# EAGLE design TALLER2 (EAGLE 7.6.0)
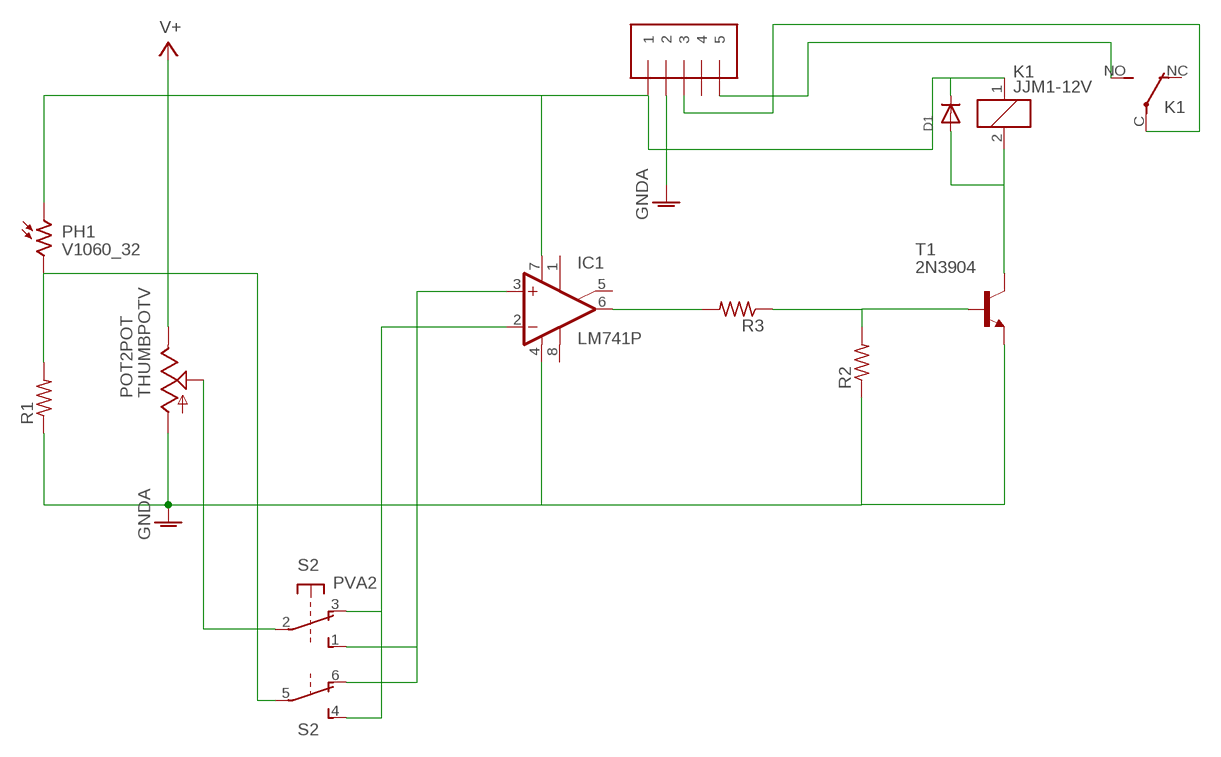
[diagram p0: schematic, sheet 1]

## Parts
D1  DIODEDO-1N4148  [DO-1N4148]
IC1  LM741P  [DIL08]
J2  1X5  [1X05-3.5MM]
K1  JJM1-12V  [JJM1C]
PH1  V1060_32  [TO-5_V10]
POT2  THUMBPOTV  [THUMBWHEELV]
R1  R-US_0207/10  [0207/10]
R2  R-US_0207/10  [0207/10]
R3  R-US_0207/10  [0207/10]
S2  PVA2  [PVA2F]
T1  2N3904  [TO92]

## Nets
GNDA: IC1.4(V-) J2.2 POT2.A(POT:A) R1.1 R2.1 T1.3(E)
N$2: PH1.2 R1.2 S2.5(2:P)
N$4: POT2.S(POT:S) S2.2(1:P)
N$5: IC1.2(-IN) S2.3(1:O) S2.4(2:S)
N$6: IC1.3(+IN) S2.1(1:S) S2.6(2:O)
N$7: IC1.6(OUT) R3.2
N$8: R2.2 R3.1 T1.2(B)
N$9: D1.A K1.2 T1.1(C)
N$12: J2.5 K1.NO(2:S)
N$13: J2.3 K1.C(2:P)
V+: D1.C IC1.7(V+) J2.1 K1.1 PH1.1 POT2.E(POT:E)
Unconnected: IC1.1(ON1) IC1.5(ON2) IC1.8(OPT) J2.4 K1.NC(2:O) POT2.SW1(SW:S) POT2.SW2(SW:P)

## Library data of the parts
D1 = adafruit:DIODE: Diode SMADIODE - SMA Surface Mount Package 20V 1A Schottky Diode Digikey: 641-1014-6-ND DO-1N4148 - Through Hole Small Current Diode SOD-123 20V 1 A (.5mV Vf) Schottky Diode - Digikey: MBRX120TPMSCT-ND SOD-323 10V 570mA (.38mV Vf, 3ns) Schottky Diode - Digikey: ZLLS410CT-ND SOD-523 30V 30mA Schottky Diode (RB751S-40TE61) - Digikey: RB751S-40TE61CT-ND SOT23-R/W - SOT23 Package (R = Solder Paste/Reflow Ovens, W = Hand-Soldering) BAT54Film 40V 300mA - Digikey: 497-7162-1-ND
IC1 = opams:*741: OP AMP
J2 = adafruit:1X5
K1 = relay:JJM1-12V: HALF-SIZE AUTOMOTIVE RELAY NAiS Source: http://www.mew-europe.com/.. en_ds_61210_0001.pdf; MF: AROMAT/ MATSUSHITA; MPN: JJM1-12V; OC_FARNELL: unknown; OC_NEWARK: 10C7318
PH1 = photo-elements:?1060*: Sensor Street Light control Source: http://optoelectronics.perkinelmer.com/content/Datasheets/DTS_PhotocellsB1060.pdf
POT2 = adafruit:THUMBPOT: Thumbwheel pot with switch Available in horizontal (Alpha RV121SF) or vertical (Xicon 311-1701)
R1-R3 = adafruit:R-US_: RESISTOR, American symbol
S2 = switch-misc:PVA2: ITT SWITCH
T1 = transistor:2N3904: NPN TRANSISTOR

## Board
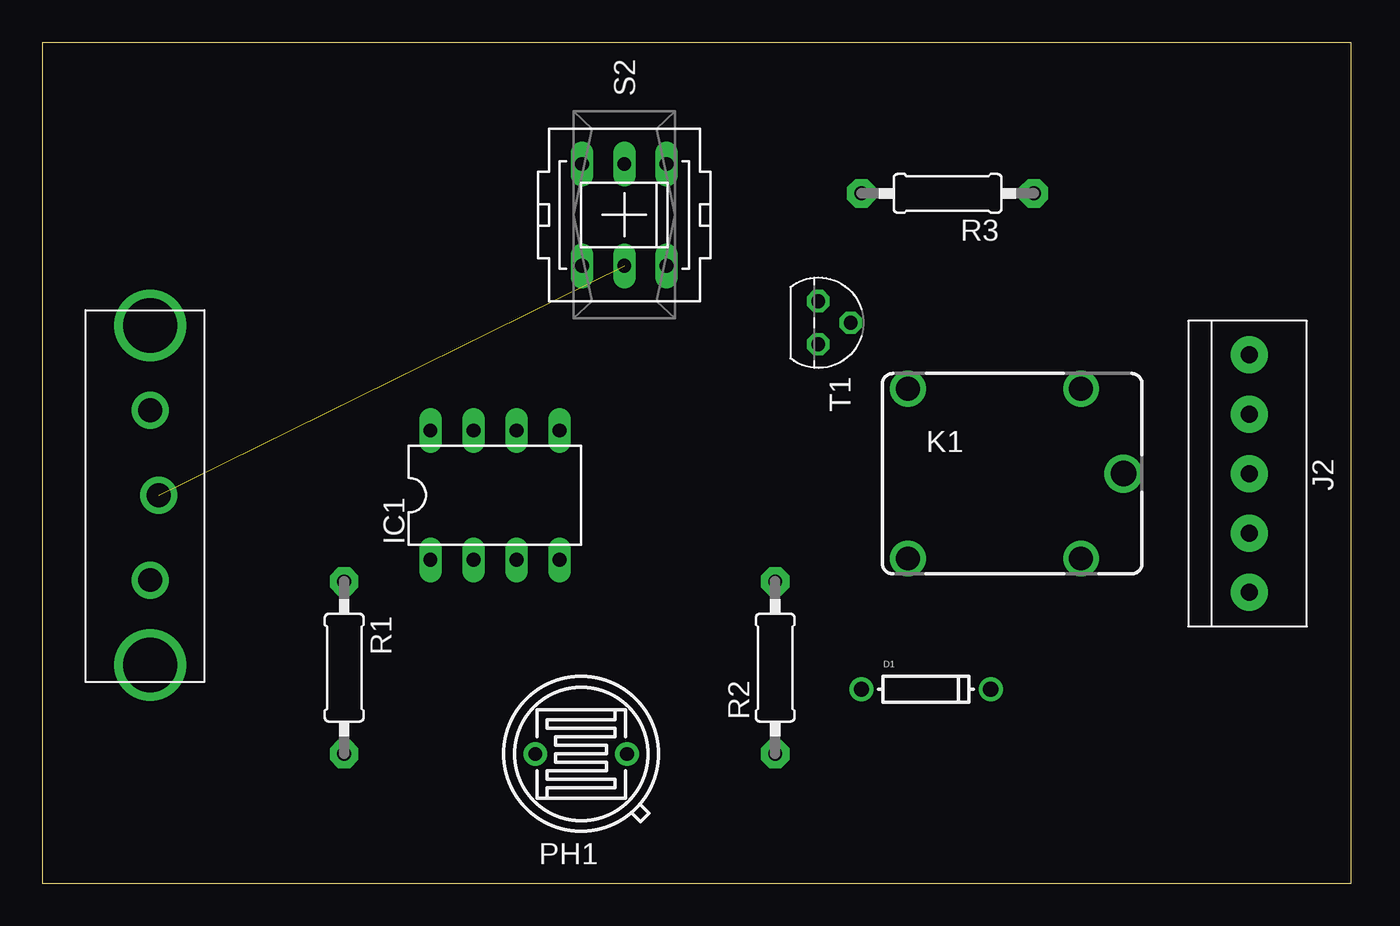
[diagram p1: board, top side]
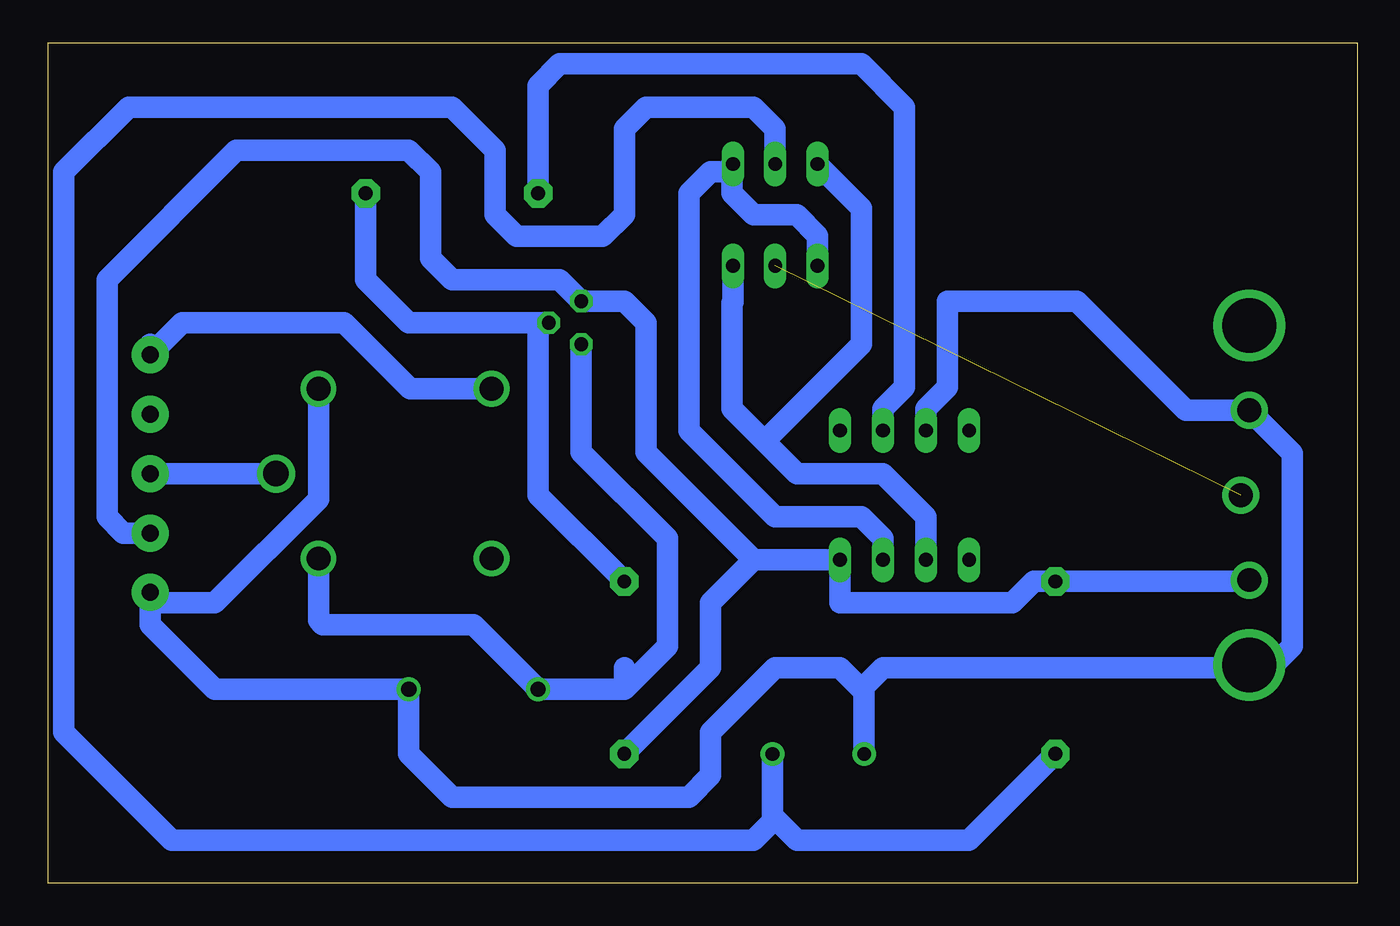
[diagram p2: board, bottom side, seen from below]

Size 77.14 x 49.52 mm. Coordinates in mm from the lower left corner, seen from the top.
Outline: 0,0 77.14,0 77.14,49.52 0,49.52 0,0
Copper layers (1*16): Top 0.035mm / dielectric 1.5mm / Bottom 0.035mm
Design rules "default *": minimum track width 10mil, minimum drill 24mil, track to track 20mil, track to pad 25mil, pad to pad 8mil, via to via 8mil, smd to smd 8mil, copper to edge 40mil, drill to drill 8mil, minimum pad ring 10mil, minimum via ring 8mil, stop-mask expansion 4mil, vias tented up to drill 0mil, thermal gap 10mil

### Footprints (pad centres in the part's own frame; a part is rotated, then mirrored left to right if it is on the bottom)
DO-1N4148 = drill 0.9: A -3.81,0; C 3.81,0
DIL08 = drill 0.813 long: 1 -3.81,-3.81; 2 -1.27,-3.81; 3 1.27,-3.81; 4 3.81,-3.81; 5 3.81,3.81; 6 1.27,3.81; 7 -1.27,3.81; 8 -3.81,3.81
1X05-3.5MM = drill 1 pad 2.184: 1 7,0; 2 3.5,0; 3 0,0; 4 -3.5,0; 5 -7,0
JJM1C = drill 1.4: 1 4.05,5; 2 4.05,-5; NC -6.15,-5; NO -6.15,5 | drill 1.5: C 6.55,0
TO-5_V10 = drill 0.8 pad 1.4: 1 -2.7,0; 2 2.7,0
THUMBWHEELV = drill 1.4 pad 2.184: A -5,0; E 5,0; S 0,-0.5 | drill 3.2: SW1 -10,0; SW2 10,0
0207/10 = drill 0.813 pad 1.676 octagon: 1 -5.08,0; 2 5.08,0
PVA2F = drill 0.813 long: 1 -2.997,2.489; 2 -2.997,0; 3 -2.997,-2.489; 4 2.997,2.489; 5 2.997,0; 6 2.997,-2.489
TO92 = drill 0.813 octagon: 1 1.27,0; 2 0,1.905; 3 -1.27,0

### Placement (x,y rotation side)
D1  52.07,11.43 0 top
IC1  26.67,22.86 0 top
J2  71.12,24.13 270 top
K1  57.15,24.13 0 top
PH1  31.75,7.62 0 top
POT2  6.35,22.86 90 top
R1  17.78,12.7 270 top
R2  43.18,12.7 90 top
R3  53.34,40.64 180 top
S2  34.29,39.37 90 top
T1  45.72,33.02 270 top

### Tracks (layer width: path | path; a pad name or v marks a point on that pad's centre or on a via)
GNDA
  Bottom 1.27: POT2.A 6.43,17.78 R1.1 19.05,17.78 20.32,16.51 30.48,16.51 IC1.4 35.56,19.05 | R2.1 38.1,12.7 38.1,16.51 35.56,19.05 | J2.2 72.7,20.63 73.66,21.59 73.66,35.56 66.04,43.18 55.88,43.18 54.61,41.91 54.61,36.83 53.34,35.56 46.99,35.56 T1.3 43.18,34.29 41.91,33.02 41.91,25.4 35.56,19.05
N$2
  Bottom 1.27: R1.2 22.86,2.54 33.02,2.54 34.45,3.97 PH1.2 34.45,3.65 35.56,2.54 69.85,2.54 76.2,8.89 76.2,41.91 72.39,45.72 53.34,45.72 50.8,43.18 50.8,39.37 49.53,38.1 44.45,38.1 43.18,39.37 43.18,44.45 41.91,45.72 35.56,45.72 34.29,44.45 S2.5
N$4  (1 unrouted)
N$5
  Bottom 1.27: IC1.2 25.4,21.59 27.94,24.13 33.02,24.13 34.92,26.04 | S2.4 29.21,39.78 29.21,31.75 34.92,26.04 | S2.3 36.78,34.24 36.83,34.19 36.83,27.94 34.92,26.04
N$6
  Bottom 1.27: S2.1 31.8,38.15 33.02,39.37 35.56,39.37 36.83,40.64 36.83,42.32 S2.6 37.24,41.91 38.1,41.91 39.37,40.64 39.37,26.67 34.29,21.59 29.21,21.59 27.94,20.32 IC1.3
N$7
  Bottom 1.27: R3.2 48.26,46.99 46.99,48.26 29.21,48.26 26.67,45.72 26.67,29.21 27.94,27.94 IC1.6
N$8
  Bottom 1.27: 48.26,33.02 T1.2 | R2.2 48.26,22.86 48.26,33.02 | 48.26,33.02 55.88,33.02 58.42,35.56 R3.1
N$9
  Bottom 1.27: T1.1 45.72,25.4 40.64,20.32 40.64,13.97 43.18,11.43 | 43.18,11.43 D1.A 52.07,15.24 60.96,15.24 61.2,15.48 K1.2 | 43.18,11.43 43.18,12.7
N$12
  Bottom 1.27: 71.12,31.75 J2.5 69.23,33.02 59.69,33.02 55.8,29.13 K1.NO
N$13
  Bottom 1.27: K1.C J2.3
V+
  Bottom 1.27: 71.12,16.51 71.12,15.24 67.31,11.43 D1.C 55.88,7.62 53.34,5.08 39.37,5.08 38.1,6.35 38.1,8.89 34.29,12.7 30.48,12.7 29.05,11.27 PH1.1 29.05,11.59 27.94,12.7 5.08,12.7 3.81,13.97 3.81,25.32 POT2.E 10.08,27.86 16.51,34.29 24.13,34.29 24.13,29.21 25.4,27.94 IC1.7 | 71.12,16.51 J2.1 | K1.1 61.2,22.62 67.31,16.51 71.12,16.51